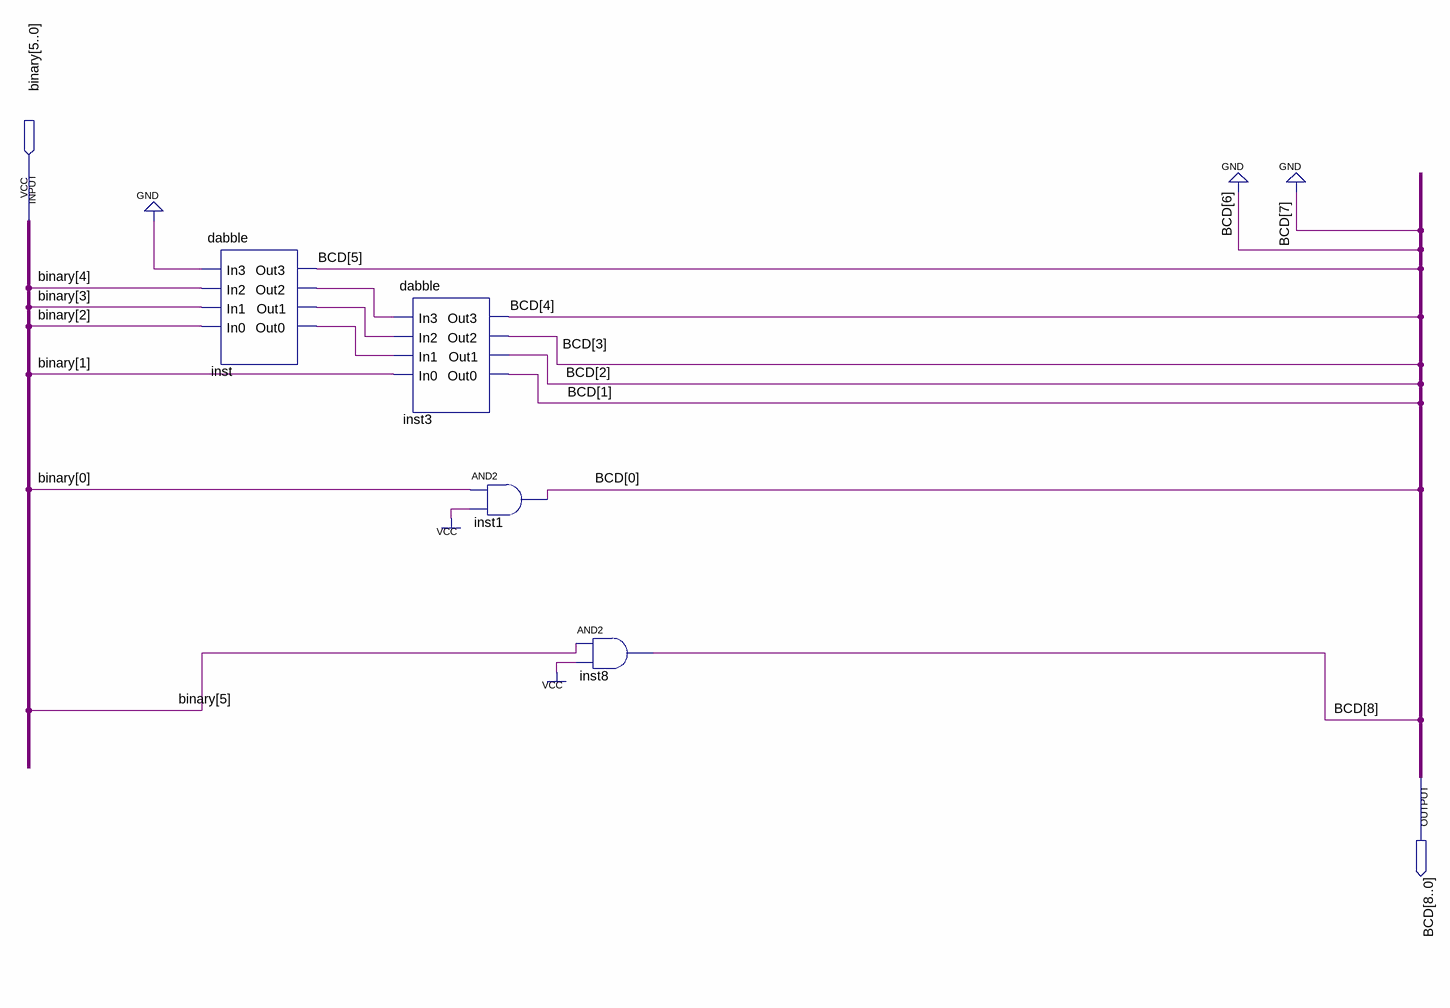
[diagram p0: schematic sheet]
// Quartus schematic binary_to_bcd.bdf as structural Verilog: 4 symbols, 2 pins
module binary_to_bcd (
  input  [5:0] binary,
  output [8:0] BCD
);

  wire inst_out0, inst_out1, inst_out2;

  dabble inst (
    .In3(1'b0), .In2(binary[4]), .In1(binary[3]), .In0(binary[2]), .Out3(BCD[5]), .Out2(inst_out2),
    .Out1(inst_out1), .Out0(inst_out0));
  dabble inst3 (
    .In3(inst_out2), .In2(inst_out1), .In1(inst_out0), .In0(binary[1]), .Out3(BCD[4]), .Out2(BCD[3]),
    .Out1(BCD[2]), .Out0(BCD[1]));
  and inst1 (BCD[0], binary[0], 1'b1);
  and inst8 (BCD[8], binary[5], 1'b1);

  assign BCD[7:6] = 2'b00;
endmodule
